# Altium schematic sheet [05] POW_LD.SchDoc
size A4; SheetNumber: 4; SheetTotal: 4
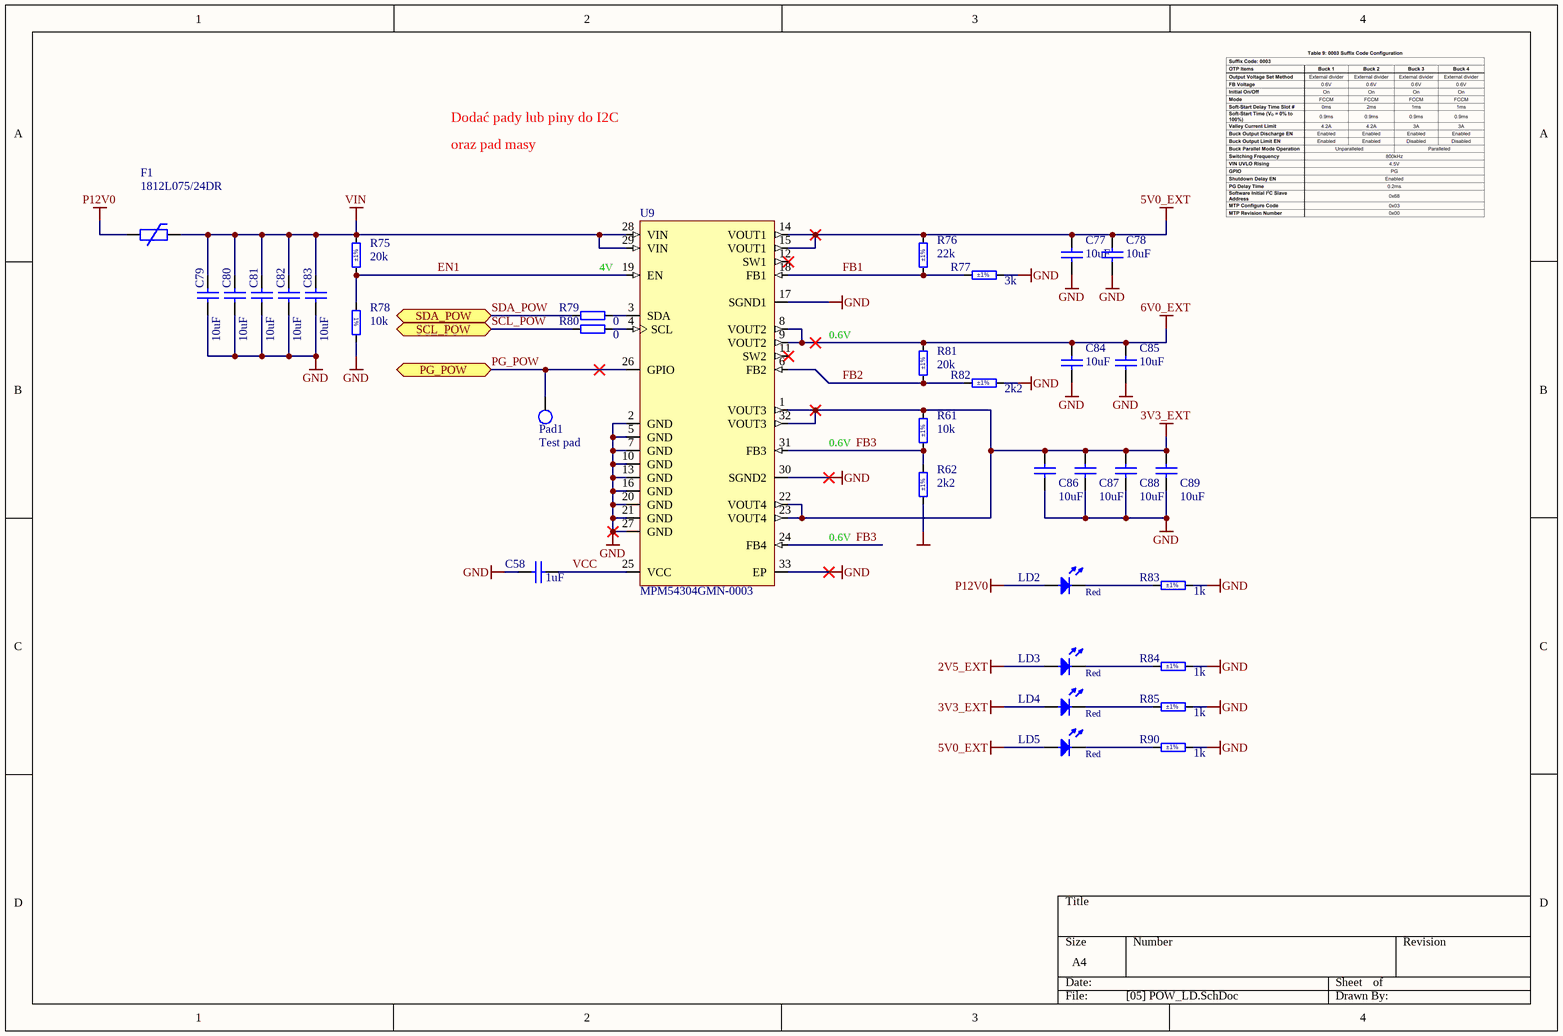
[diagram p0: [05] POW_LD.SchDoc]

## Parts
C58  1uF  [CAPC1005X55N]
C77  10uF  [CAPC2012X145N]
C78  10uF  [CAPC2012X145N]
C79  10uF  [CAPC2012X145N]
C80  10uF  [CAPC2012X145N]
C81  10uF  [CAPC2012X145N]
C82  10uF  [CAPC2012X145N]
C83  10uF  [CAPC2012X145N]
C84  10uF  [CAPC2012X145N]
C85  10uF  [CAPC2012X145N]
C86  10uF  [CAPC2012X145N]
C87  10uF  [CAPC2012X145N]
C88  10uF  [CAPC2012X145N]
C89  10uF  [CAPC2012X145N]
F1  1812L075/24DR  [F0805]
LD2  Red  [LED_KINGBRIGHT_KP-1608SURCK]
LD3  Red  [LED_KINGBRIGHT_KP-1608SURCK]
LD4  Red  [LED_KINGBRIGHT_KP-1608SURCK]
LD5  Red  [LED_KINGBRIGHT_KP-1608SURCK]
Pad1  Test pad  [Pad 1mm]  (net tie, no BOM)
R61  10k  Tolerance: ±1%  [RESC1005X40N]
R62  2k2  Tolerance: ±1%  [RESC1005X40N]
R75  20k  Tolerance: ±1%  [RESC1005X40N]
R76  22k  Tolerance: ±1%  [RESC1005X40N]
R77  3k  Tolerance: ±1%  [RESC1005X40N]
R78  10k  [RESC1005X40N]
R79  0  [RESC1005X40N]
R80  0  [RESC1005X40N]
R81  20k  Tolerance: ±1%  [RESC1005X40N]
R82  2k2  Tolerance: ±1%  [RESC1005X40N]
R83  1k  Tolerance: ±1%  [RESC1005X40N]
R84  1k  Tolerance: ±1%  [RESC1005X40N]
R85  1k  Tolerance: ±1%  [RESC1005X40N]
R90  1k  Tolerance: ±1%  [RESC1005X40N]
U9  MPM54304GMN-0003  [PowerFLGA-33]

## Ports
PG_POW (bidir), SCL_POW (bidir), SDA_POW (bidir)

## Nets
2V5_EXT: LD3.2(A)
3V3_EXT: C86.2 C87.2 C88.2 C89.2 LD4.2(A) R61.2 U9.1(VOUT3) U9.22(VOUT4) U9.23(VOUT4) U9.32(VOUT3)
5V0_EXT: C77.2 C78.2 LD5.2(A) R76.2 U9.14(VOUT1) U9.15(VOUT1)
6V0_EXT: C84.2 C85.2 R81.1 U9.8(VOUT2) U9.9(VOUT2)
GND: C58.2 C77.1 C78.1 C79.1 C80.1 C81.1 C82.1 C83.1 C84.1 C85.1 C86.1 C87.1 C88.1 C89.1 R62.1 R77.2 R78.2 R82.2 R83.2 R84.2 R85.2 R90.2 U9.2(GND) U9.5(GND) U9.7(GND) U9.10(GND) U9.13(GND) U9.16(GND) U9.17(SGND1) U9.20(GND) U9.21(GND) U9.27(GND) U9.30(SGND2) U9.33(EP)
P12V0: F1.1 LD2.2(A)
VIN: C79.2 C80.2 C81.2 C82.2 C83.2 F1.2 R75.1 U9.28(VIN) U9.29(VIN)
EN1: R75.2 R78.1 U9.19(EN)
FB1: R76.1 R77.1 U9.18(FB1)
FB2: R81.2 R82.1 U9.6(FB2)
FB3: R61.1 R62.2 U9.24(FB4) U9.31(FB3)
PG_POW: Pad1.1 U9.26(GPIO) ; port PG_POW
SCL_POW: R80.1 ; port SCL_POW
SDA_POW: R79.1 ; port SDA_POW
VCC: C58.1 U9.25(VCC)
NetLD2_1: LD2.1(C) R83.1
NetLD3_1: LD3.1(C) R84.1
NetLD4_1: LD4.1(C) R85.1
NetLD5_1: LD5.1(C) R90.1
NetR79_2: R79.2 U9.3(SDA)
NetR80_2: R80.2 U9.4(SCL)

Not connected (* = marked no-connect by the designer): U9 11(SW2)* 12(SW1)*

## Notes on the sheet
- Dodać pady lub piny do I2C
- oraz pad masy
- 4V
- 0.6V
- (in symbol R0402_10K_1%_0.0625W_100PPM) 1%

## Library data of the parts
C58 = CC0402_1UF_25V_10%_X5R: Non-polarised capacitor; Part Description: SMD Multilayer Chip Ceramic Capacitor; Manufacturer: GENERIC; Manufacturer1 Part Number: C1005X5R1E105K050; Voltage: 25V; TC: X5R; Tolerance: ±10%; Part Number: CC0402_1UF_25V_10%_X5R; Component Kind: Standard; Component Type: Standard; Pin Count: 2; Value: 1uF; Status: Preferred; Manufacturer Part Number: CC0402_1UF_25V_10%_X5R; Case: 0402; Mounted: Yes; Socket: No; SMD: Yes; Sense: No; Manufacturer1 Example: TDK; Manufacturer1 ComponentHeight: 0.55mm; HelpURL: \\cern.ch\dfs\Applications\Altium\Datasheets\CC0402_X5R_TDK_C.pdf; Author: CERN DEM BC; CreateDate: 17.02.2020; LatestRevisionDate: 17.02.2020
C77-C89 = CC0805_10UF_25V_10%_X7R: Non-polarised capacitor; Part Description: SMD Multilayer Chip Ceramic Capacitor; Manufacturer: GENERIC; Manufacturer1 Part Number: GRM21BZ71E106KE15; Voltage: 25V; TC: X7R; Tolerance: ±10%; Part Number: CC0805_10UF_25V_10%_X7R; Component Kind: Standard; Component Type: Standard; Pin Count: 2; Value: 10uF; Status: Preferred; Manufacturer Part Number: CC0805_10UF_25V_10%_X7R; Case: 0805; Mounted: Yes; Socket: No; SMD: Yes; Sense: No; Manufacturer1 Example: MURATA; Manufacturer1 ComponentHeight: 1.45mm; HelpURL: \\cern.ch\dfs\Applications\Altium\Datasheets\CC0805_MURATA_GRM21BZ71E106KE15.pdf; Author: CERN DEM HF; CreateDate: 16.05.2023; LatestRevisionDate: 16.05.2023
F1 = 1812L075: Bezpiecznik: polimerowy PTC; 750mA; 1812L; Manufacture: Littelfuse; Tolerance1: 0.1 - 0.45; Assembly: SMD; Value2: 24V; Parameter1: Ihold; Parameter2: V; Tolerance2: ± %; Parameter3: Res; ComponentLink1URL: http://www.tme.eu/pl/Document/71c32c9c3cb7bbfe5a74435d883a7bd8/8701984.pdf; ComponentLink2URL: *; ComponentLink1Description: Datasheet; ComponentLink2Description: *; Value1: *; Shop1ID: *; ComponentType: Fuse PTC; DafaultFootprint: 1812L; ComponentSymbol: 1812L075/24DR
LD2-LD5 = LED_KINGBRIGHT_KP-1608SURCK: LED Red 1C 2A; Part Description: 1.6x0.8mm SMD Chip Hyper Red LED Lamp; PressFit: No; Bonding: No; Part Number: LED_KINGBRIGHT_KP-1608SURCK; Component Kind: Standard; Component Type: Standard; Color: Red; PackageDescription: SMT Hyper Red LED, Case 0603, Body L 1.60mm x W 0.80mm x H 1.10mm; Manufacturer: KINGBRIGHT; Manufacturer Part Number: KP-1608SURCK; Pin Count: 2; Case: 0603; Mounted: Yes; Socket: No; SMD: Yes; Sense: No; ComponentHeight: 1.1mm; HelpURL: \\cern.ch\dfs\Applications\Altium\Datasheets\LED_KINGBRIGHT_KP-1608SURCK.pdf; Author: CERN DEM HF; CreateDate: 01.10.2021; LatestRevisionDate: 01.10.2021
R61 R78 = R0402_10K_1%_0.0625W_100PPM: Resistor - 1%; Part Description: General Purpose Thick Film Chip Resistor; Manufacturer: GENERIC; Manufacturer1 Part Number: 232270671003L; TC: ±100ppm/°C; PressFit: No; Part Number: R0402_10K_1%_0.0625W_100PPM; Component Kind: Standard; Component Type: Standard; Pin Count: 2; Value: 10k; Status: Not Recommended; Power: 0.0625W; Manufacturer Part Number: R0402_10K_1%_0.0625W_100PPM; Case: 0402; Mounted: Yes; Sense: No; Socket: No; SMD: Yes; Manufacturer1 Example: YAGEO PHYCOMP; Manufacturer1 ComponentHeight: 0.4mm; HelpURL: \\cern.ch\dfs\Applications\Altium\Datasheets\R0402_Phycomp_RC0402.pdf; Author: CERN DEM JLC
  R61: CreateDate: 03.12.2007; LatestRevisionDate: 17.10.2012
  R78: Tolerance: ±1%; CreateDate: 03/12/2007; LatestRevisionDate: 17/10/2012
R62 R82 = R0402_2K2_1%_0.0625W_100PPM: Resistor - 1%; Part Description: General Purpose Thick Film Chip Resistor; Manufacturer: GENERIC; Manufacturer1 Part Number: 232270672202L; TC: ±100ppm/°C; PressFit: No; Part Number: R0402_2K2_1%_0.0625W_100PPM; Component Kind: Standard; Component Type: Standard; Pin Count: 2; Value: 2k2; Status: Not Recommended; Power: 0.0625W; Manufacturer Part Number: R0402_2K2_1%_0.0625W_100PPM; Case: 0402; Mounted: Yes; Sense: No; Socket: No; SMD: Yes; Manufacturer1 Example: YAGEO PHYCOMP; Manufacturer1 ComponentHeight: 0.4mm; HelpURL: \\cern.ch\dfs\Applications\Altium\Datasheets\R0402_Phycomp_RC0402.pdf; Author: CERN DEM JLC; CreateDate: 03.12.2007; LatestRevisionDate: 17.10.2012
R75 R81 = R0402_20K_1%_0.0625W_100PPM: Resistor - 1%; Part Description: General Purpose Thick Film Chip Resistor; Manufacturer: GENERIC; Manufacturer1 Part Number: 232270672003L; TC: ±100ppm/°C; PressFit: No; Part Number: R0402_20K_1%_0.0625W_100PPM; Component Kind: Standard; Component Type: Standard; Pin Count: 2; Value: 20k; Status: Not Recommended; Power: 0.0625W; Manufacturer Part Number: R0402_20K_1%_0.0625W_100PPM; Case: 0402; Mounted: Yes; Sense: No; Socket: No; SMD: Yes; Manufacturer1 Example: YAGEO PHYCOMP; Manufacturer1 ComponentHeight: 0.4mm; HelpURL: \\cern.ch\dfs\Applications\Altium\Datasheets\R0402_Phycomp_RC0402.pdf; Author: CERN DEM JLC; CreateDate: 03.12.2007; LatestRevisionDate: 17.10.2012
R76 = R0402_22K_1%_0.0625W_100PPM: Resistor - 1%; Part Description: General Purpose Thick Film Chip Resistor; Manufacturer: GENERIC; Manufacturer1 Part Number: 232270672203L; TC: ±100ppm/°C; PressFit: No; Part Number: R0402_22K_1%_0.0625W_100PPM; Component Kind: Standard; Component Type: Standard; Pin Count: 2; Value: 22k; Status: Not Recommended; Power: 0.0625W; Manufacturer Part Number: R0402_22K_1%_0.0625W_100PPM; Case: 0402; Mounted: Yes; Sense: No; Socket: No; SMD: Yes; Manufacturer1 Example: YAGEO PHYCOMP; Manufacturer1 ComponentHeight: 0.4mm; HelpURL: \\cern.ch\dfs\Applications\Altium\Datasheets\R0402_Phycomp_RC0402.pdf; Author: CERN DEM JLC; CreateDate: 03.12.2007; LatestRevisionDate: 17.10.2012
R77 = R0402_3K_1%_0.0625W_100PPM: Resistor - 1%; Part Description: General Purpose Thick Film Chip Resistor; Manufacturer: GENERIC; Manufacturer1 Part Number: 232270673002L; TC: ±100ppm/°C; PressFit: No; Part Number: R0402_3K_1%_0.0625W_100PPM; Component Kind: Standard; Component Type: Standard; Pin Count: 2; Value: 3k; Status: Not Recommended; Power: 0.0625W; Manufacturer Part Number: R0402_3K_1%_0.0625W_100PPM; Case: 0402; Mounted: Yes; Sense: No; Socket: No; SMD: Yes; Manufacturer1 Example: YAGEO PHYCOMP; Manufacturer1 ComponentHeight: 0.4mm; HelpURL: \\cern.ch\dfs\Applications\Altium\Datasheets\R0402_Phycomp_RC0402.pdf; Author: CERN DEM JLC; CreateDate: 03.12.2007; LatestRevisionDate: 17.10.2012
R79 R80 = R0402_0R_JUMPER: Resistor; Part Description: 1A (0.05R Max DC Resistance) Zero Ohm Jumper; Manufacturer: GENERIC; Manufacturer1 Part Number: 232270591001L; PressFit: No; Part Number: R0402_0R_JUMPER; Component Kind: Standard; Component Type: Standard; Pin Count: 2; Value: 0; Status: Not Recommended; Manufacturer Part Number: R0402_0R_JUMPER; Case: 0402; Mounted: Yes; Sense: No; Socket: No; SMD: Yes; Manufacturer1 Example: YAGEO PHYCOMP; Manufacturer1 ComponentHeight: 0.4mm; HelpURL: \\cern.ch\dfs\Applications\Altium\Datasheets\R0402_Phycomp_RC0402.pdf; Author: CERN DEM JLC; CreateDate: 03.12.2007; LatestRevisionDate: 17.10.2012
R83-R85 R90 = R0402_1K_1%_0.0625W_100PPM: Resistor - 1%; Part Description: General Purpose Thick Film Chip Resistor; Manufacturer: GENERIC; Manufacturer1 Part Number: 232270671002L; TC: ±100ppm/°C; PressFit: No; Part Number: R0402_1K_1%_0.0625W_100PPM; Component Kind: Standard; Component Type: Standard; Pin Count: 2; Value: 1k; Status: Not Recommended; Power: 0.0625W; Manufacturer Part Number: R0402_1K_1%_0.0625W_100PPM; Case: 0402; Mounted: Yes; Sense: No; Socket: No; SMD: Yes; Manufacturer1 Example: YAGEO PHYCOMP; Manufacturer1 ComponentHeight: 0.4mm; HelpURL: \\cern.ch\dfs\Applications\Altium\Datasheets\R0402_Phycomp_RC0402.pdf; Author: CERN DEM JLC; CreateDate: 03.12.2007; LatestRevisionDate: 17.10.2012
U9 = MPM54304GMN-0003: Buck Switching Regulator IC Positive Adjustable 0.55V 4 Output 2A, 3A 33-PowerFLGA Module; Manufacture: Monolithic Power Systems Inc.; Assembly: SMD; Parameter1: Vin min; Parameter2: Vin max; Parameter3: Fsw; Shop1: Digi-Key; Shop1ID: 1589-MPM54304GMN-0003-ND; Value1: 4.0V; Value2: 16V; Value3: 500kHz-1.6MHz; ComponentLink1Description: Datasheet; ComponentLink1URL: https://www.monolithicpower.com/en/documentview/productdocument/index/version/2/document_type/Datasheet/lang/en/sku/MPM54304/document_id/4982/; ComponentLink2Description: Eval Board; ComponentLink2URL: https://www.monolithicpower.com/en/documentview/productdocument/index/version/2/document_type/Datasheet/lang/en/sku/EVM54304-MN-01A/document_id/9460/; ComponentSymbol: MPM54304GMN-0003; ComponentType: IC DC/DC LDO; DafaultFootprint: PowerFLGA-33